# EAGLE design TubesSems3 (EAGLE 9.6.2)
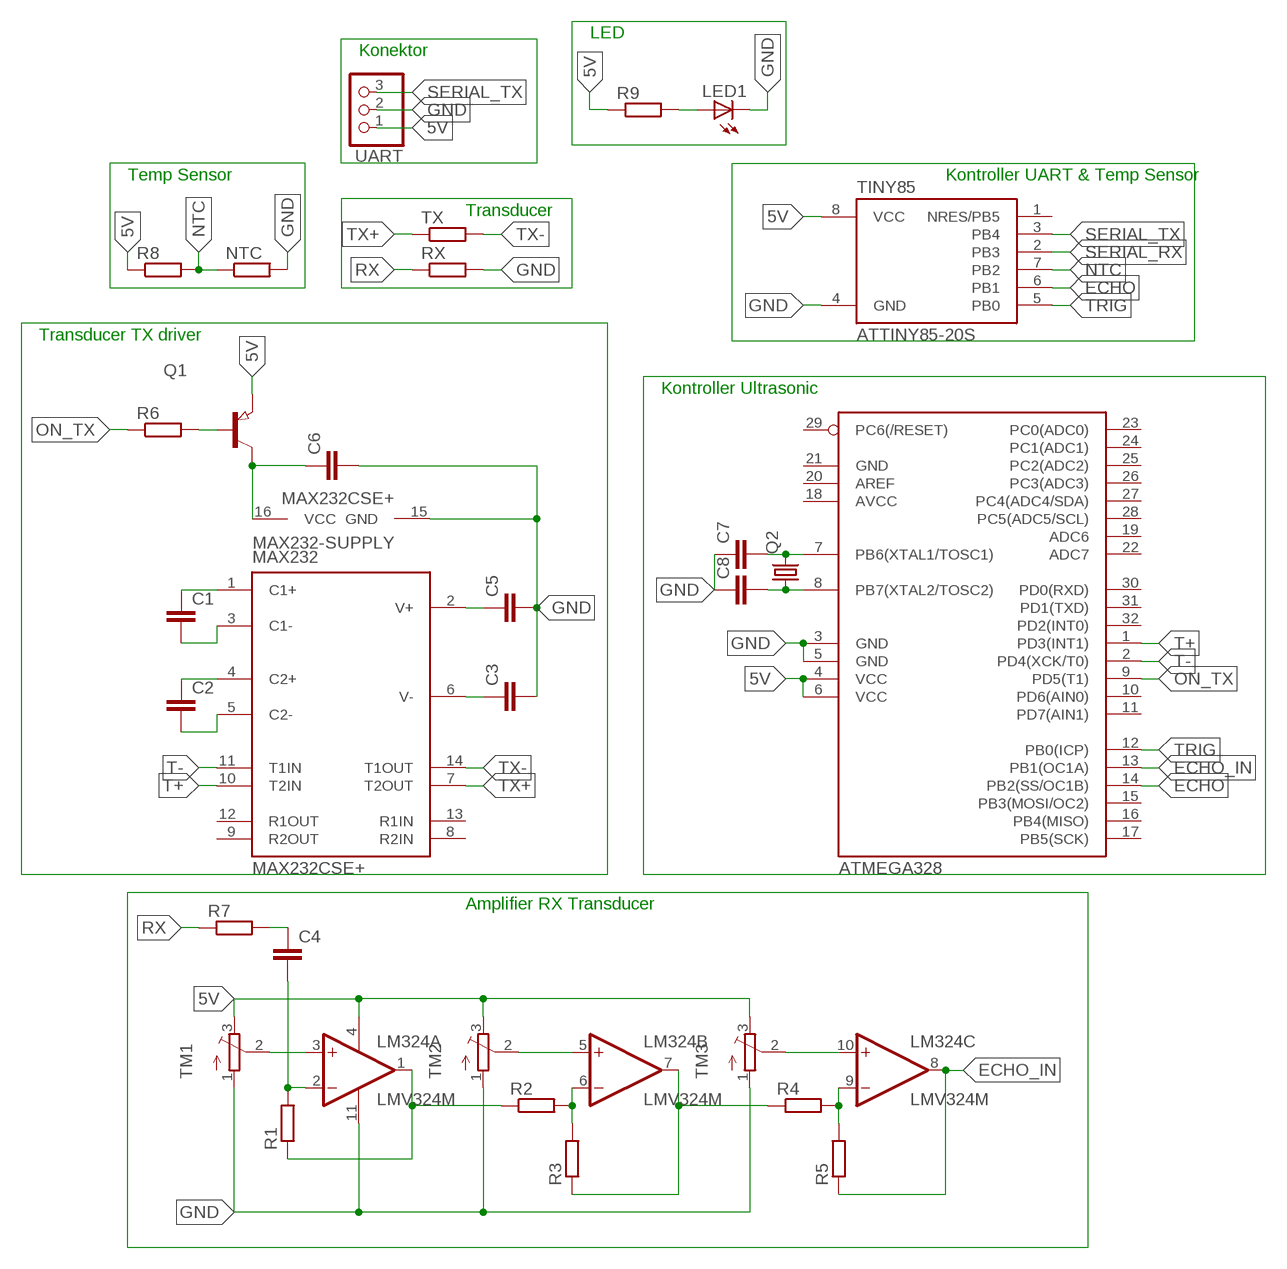
[diagram p0: schematic, sheet 1]

## Parts
ATMEGA328  MEGA8-AI  [TQFP32-08]
C1  C-EUC0603  [C0603]
C2  C-EUC0603  [C0603]
C3  C-EUC0603  [C0603]
C4  C-EUC0603  [C0603]
C5  C-EUC0603  [C0603]
C6  C-EUC0603  [C0603]
C7  C-EUC0805  [C0805]
C8  C-EUC0805  [C0805]
LED1  LEDCHIPLED_1206  [CHIPLED_1206]
LM324  LMV324M  [SO14]
MAX232  MAX232CSE+  [SO-16]
NTC  R-EU_R0805  [R0805]
Q1  PNP-TRANSISTOR_SOT23  [SOT23]
Q2  CRYSTALSM49  [SM49]
R1  R-EU_R1206  [R1206]
R2  R-EU_R1206  [R1206]
R3  R-EU_R1206  [R1206]
R4  R-EU_R1206  [R1206]
R5  R-EU_R1206  [R1206]
R6  R-EU_R1206  [R1206]
R7  R-EU_R1206  [R1206]
R8  R-EU_R0805  [R0805]
R9  R-EU_M1206  [M1206]
RX  R-EU_0207/11  [0207/11]
TINY85  ATTINY85-20S  [SOIC8_EIAJ_208MIL]
TM1  TRIMPOTTC33X  [TC33X]
TM2  TRIMPOTTC33X  [TC33X]
TM3  TRIMPOTTC33X  [TC33X]
TX  R-EU_0207/11  [0207/11]
UART  PINHD-1X3  [1X03]

## Nets
5V: ATMEGA328.4(VCC) ATMEGA328.6(VCC) LM324.4(P:V+) Q1.2(E) R8.1 R9.1 TINY85.8(VCC) TM1.3(E) TM2.3(E) TM3.3(E) UART.1
ECHO: ATMEGA328.14(PB2(SS/OC1B)) TINY85.6(PB1)
ECHO_IN: ATMEGA328.13(PB1(OC1A)) LM324.8(C:OUT) R5.1
GND: ATMEGA328.3(GND) ATMEGA328.5(GND) C3.2 C5.2 C6.2 C7.1 C8.1 LED1.C LM324.11(P:V-) MAX232.15(GND) NTC.2 RX.2 TINY85.4(GND) TM1.1(A) TM2.1(A) TM3.1(A) UART.2
N$1: C1.1 MAX232.1(C1+)
N$2: C1.2 MAX232.3(C1-)
N$3: C2.1 MAX232.4(C2+)
N$4: C2.2 MAX232.5(C2-)
N$5: C3.1 MAX232.6(V-)
N$6: C5.1 MAX232.2(V+)
N$7: ATMEGA328.7(PB6(XTAL1/TOSC1)) C7.2 Q2.2
N$8: C6.1 MAX232.16(VCC) Q1.3(C)
N$9: LM324.3(A:+IN) TM1.2(S)
N$10: C4.2 LM324.2(A:-IN) R1.2
N$11: LM324.1(A:OUT) R1.1 R2.1
N$12: LM324.5(B:+IN) TM2.2(S)
N$13: LM324.6(B:-IN) R2.2 R3.2
N$14: Q1.1(B) R6.2
N$15: LM324.7(B:OUT) R3.1 R4.1
N$16: LM324.10(C:+IN) TM3.2(S)
N$17: LM324.9(C:-IN) R4.2 R5.2
N$18: ATMEGA328.8(PB7(XTAL2/TOSC2)) C8.2 Q2.1
N$19: C4.1 R7.2
N$27: LED1.A R9.2
NTC: NTC.1 R8.2 TINY85.7(PB2)
ON_TX: ATMEGA328.9(PD5(T1)) R6.1
RX: R7.1 RX.1
SERIAL_RX: TINY85.2(PB3)
SERIAL_TX: TINY85.3(PB4) UART.3
T+: ATMEGA328.1(PD3(INT1)) MAX232.10(T2IN)
T-: ATMEGA328.2(PD4(XCK/T0)) MAX232.11(T1IN)
TRIG: ATMEGA328.12(PB0(ICP)) TINY85.5(PB0)
TX+: MAX232.7(T2OUT) TX.1
TX-: MAX232.14(T1OUT) TX.2
Unconnected: ATMEGA328.10(PD6(AIN0)) ATMEGA328.11(PD7(AIN1)) ATMEGA328.15(PB3(MOSI/OC2)) ATMEGA328.16(PB4(MISO)) ATMEGA328.17(PB5(SCK)) ATMEGA328.19(ADC6) ATMEGA328.20(AREF) ATMEGA328.22(ADC7) ATMEGA328.23(PC0(ADC0)) ATMEGA328.24(PC1(ADC1)) ATMEGA328.25(PC2(ADC2)) ATMEGA328.26(PC3(ADC3)) ATMEGA328.27(PC4(ADC4/SDA)) ATMEGA328.28(PC5(ADC5/SCL)) ATMEGA328.29(PC6(/RESET)) ATMEGA328.30(PD0(RXD)) ATMEGA328.31(PD1(TXD)) ATMEGA328.32(PD2(INT0)) LM324.12(D:+IN) LM324.13(D:-IN) LM324.14(D:OUT) MAX232.8(R2IN) MAX232.9(R2OUT) MAX232.12(R1OUT) MAX232.13(R1IN) TINY85.1(NRES/PB5)

## Notes on the sheet
- LED
- Konektor
- Temp Sensor | Kontroller UART & Temp Sensor
- Transducer
- Transducer TX driver
- Kontroller Ultrasonic
- Amplifier RX Transducer

## Power pins joined to a net without a drawn wire
AVCC: ATMEGA328.18(AVCC)
GND: ATMEGA328.21(GND)

## Library data of the parts
ATMEGA328 = atmel:MEGA8: MICROCONTROLLER 8 Kbytes FLASH, 1 kbytes SRAM, 512 bytes EEPROM, USART, 6-channel 10 bit ADC, 2-channel 8 bit ADC Pin compatible with Atmega48, ATMega88, ATMega168 Source: avr.lbr; MPN: ATMEGA8-16AU; OC_FARNELL: 9171371; OC_NEWARK: 73M8863
C1-C8 = Clean-Kong:C-EU: CAPACITOR, European symbol
LED1 = adafruit:LED: LED OSRAM: - CHIPLED LG R971, LG N971, LY N971, LG Q971, LY Q971, LO R971, LY R971 LH N974, LH R974 LS Q976, LO Q976, LY Q976 LO Q996 - Hyper CHIPLED LW Q18S LB Q993, LB Q99A, LB R99A - SideLED LS A670, LO A670, LY A670, LG A670, LP A670 LB A673, LV A673, LT A673, LW A673 LH A674 LY A675 LS A676, LA A676, LO A676, LY A676, LW A676 LS A679, LY A679, LG A679 - Hyper Micro SIDELED® LS Y876, LA Y876, LO Y876, LY Y876 LT Y87S - SmartLED LW L88C, LW L88S LB L89C, LB L89S, LG L890 LS L89K, LO L89K, LY L89K LS L896, LA L896, LO L896, LY L896 - TOPLED LS T670, LO T670, LY T670, LG T670, LP T670 LSG T670, LSP T670, LSY T670, LOP T670, LYG T670 LG T671, LOG T671, LSG T671 LB T673, LV T673, LT T673, LW T673 LH T674 LS T676, LA T676, LO T676, LY T676, LB T676, LH T676, LSB T676, LW T676 LB T67C, LV T67C, LT T67C, LS T67K, LO T67K, LY T67K, LW E67C LS E67B, LA E67B, LO E67B, LY E67B, LB E67C, LV E67C, LT E67C LW T67C LS T679, LY T679, LG T679 LS T770, LO T770, LY T770, LG T770, LP T770 LB T773, LV T773, LT T773, LW T773 LH T774 LS E675, LA E675, LY E675, LS T675 LS T776, LA T776, LO T776, LY T776, LB T776 LHGB T686 LT T68C, LB T68C - Hyper Mini TOPLED® LB M676 - Mini TOPLED Santana® LG M470 LS M47K, LO M47K, LY M47K Source: http://www.osram.convergy.de/
LM324 = linear:LMV324?*: Quad General Purpose, Low Voltage, Rail-to-Rail Output Operational Amplifiers Source: http://www.national.com/mpf/LM/LMV321.html http://www.national.com/dt/lmv_qual.pdf
MAX232 = maxim-volks73:MAX232*?: +5V-Powered, Multichannel RS-232 Drivers/Receivers Documentation Datasheet <http://datasheets.maximintegrated.com/en/ds/MAX220-MAX249.pdf> General Description The MAX220–MAX249 family of line drivers/receivers is intended for all EIA/TIA-232E and V.28/V.24 communications interfaces, particularly applications where ±12V is not available. The MAX225, MAX233, MAX235, and MAX245/MAX246/MAX247 use no external components and are recommended for applications where printed circuit board space is critical. The MAX220-MAX249 are offered in 26 different packages with temperatures from 0 to +70°C up to -55°C to +125°C. See ordering information table at the end of the data sheet for all package and temperature options. Applications Interface Translation Multidrop RS-232 Networks Portable Diagnostics Equipment Benefits and Features Saves Board Space Integrated Charge Pump Circuitry Eliminates the Need for a Bipolar ±12V Supply Enables the Single Supply Operation from +5V Supply Integrated Capacitors (MAX223, MAX233, MAX235, MAX245-MAX247) Saves Power for Reduced Power Requirements 5μW Shutdown Mode; CATEGORY: Integrated Circuits (ICs); DATA_RATE: 120Kbps; DESCRIPTION: IC RS-232 DVR/RCVR 16-SOIC; DOCUMENTATION_LINK: <a href="http://datasheets.maximintegrated.com/en/ds/MAX220-MAX249.pdf">Datasheet</a>; DOCUMENTATION_URL: http://datasheets.maximintegrated.com/en/ds/MAX220-MAX249.pdf; DUPLEX: Full; FAMILY: Interface - Drivers, Receivers, Transceivers; MANUFACTURER: Maxim Integrated; MOUNTING_TYPE: Surface Mount; NUMBER_OF_DRIVERS-RECEIVERS: 2/2; OPERATING_TEMPERATURE: 0°C ~ 70°C; PACKAGE: 16-SOIC (0.154", 3.90mm Width); PART_NUMBER: MAX232CSE+; PROTOCOL: RS232; RECEIVER_HYSTERESIS: 500mV; SERIES: -; SUPPLIER_DEVICE_PACKAGE: 16-SOIC; SUPPLIER_ITEM_LINK: <a href="http://www.digikey.com/product-detail/en/MAX232CSE%2B/MAX232CSE%2B-ND/1513858">Details</a>; SUPPLIER_ITEM_NUMBER: MAX232CSE+-ND; SUPPLIER_ITEM_URL: http://www.digikey.com/product-detail/en/MAX232CSE%2B/MAX232CSE%2B-ND/1513858; SUPPLIER_LINK: <a href="http://www.digikey.com">Home Page</a>; SUPPLIER_NAME: Digi-Key; SUPPLIER_URL: http://www.digikey.com; TYPE: Transceiver; VOLTAGE-SUPPLY: 4.5 V ~ 5.5 V
NTC R1-R9 RX TX = Clean-Kong:R-EU_: RESISTOR, European symbol
Q1 = semicon-smd-ipc:PNP-TRANSISTOR_: PNP TRANSISTOR
Q2 = adafruit:CRYSTAL: CRYSTAL; OC_FARNELL: unknown; OC_NEWARK: unknown
TINY85 = attiny25_45_85:ATTINY85*: ATMEL ATtiny 85 Packages: P = PDIP 08 30mil S = SOIC 08 EIAJ 208mil Technologies Note: for complete ordering code (temp. range, finish, tape&reel etc.) see www.atmel.com • Supply Voltage: V = (1.8…5.5)V | [blank] = (2.7…5.5)V • Speed: 10 = 10 MHz | 20 = 20 MHz Author: Dipl.-Ing. FH Rainer Bayer HHN Hochschule Heilbronn (Heilbronn University), rainer.bayer@hs-heilbronn.de Ingenieurbüro ing-rb, mail@ing-rb.de
TM1-TM3 = adafruit:TRIMPOT: SMT trimmer potentiometer part number TC33X http://www.ladyada.net/library/eagle
UART = pinhead:PINHD-1X3: PIN HEADER

## Board
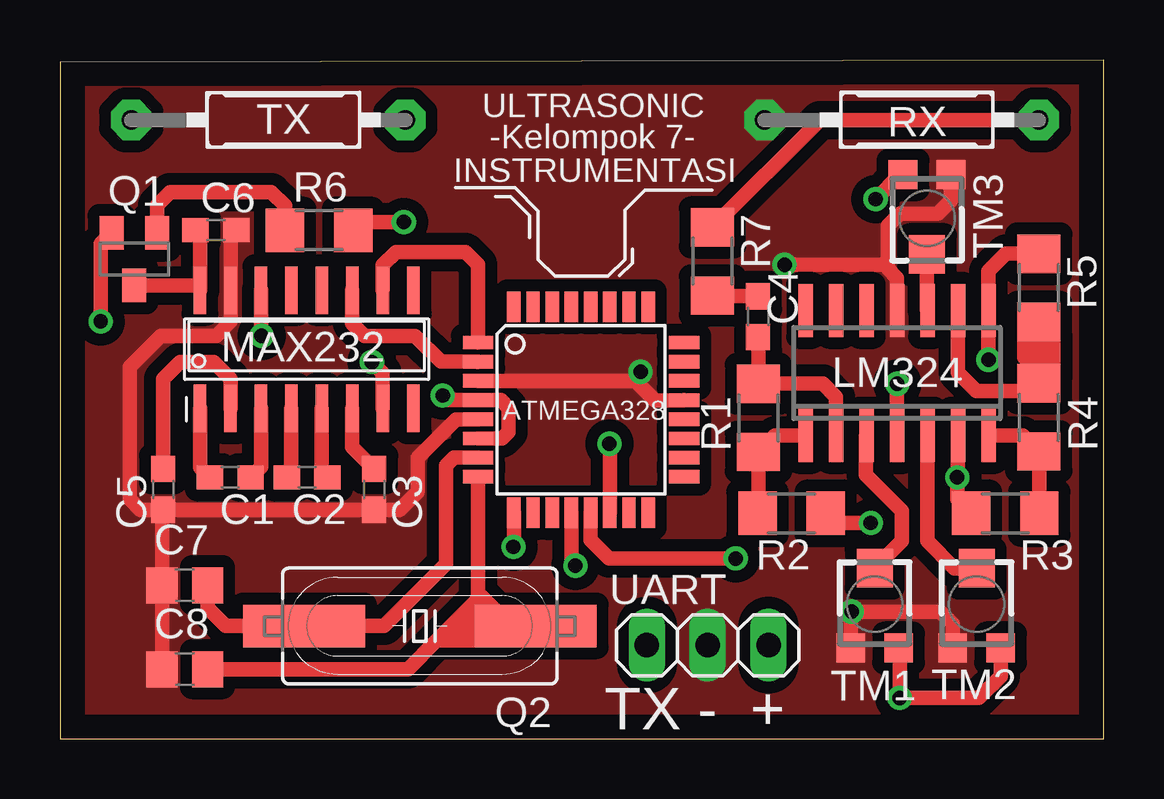
[diagram p1: board, top side]
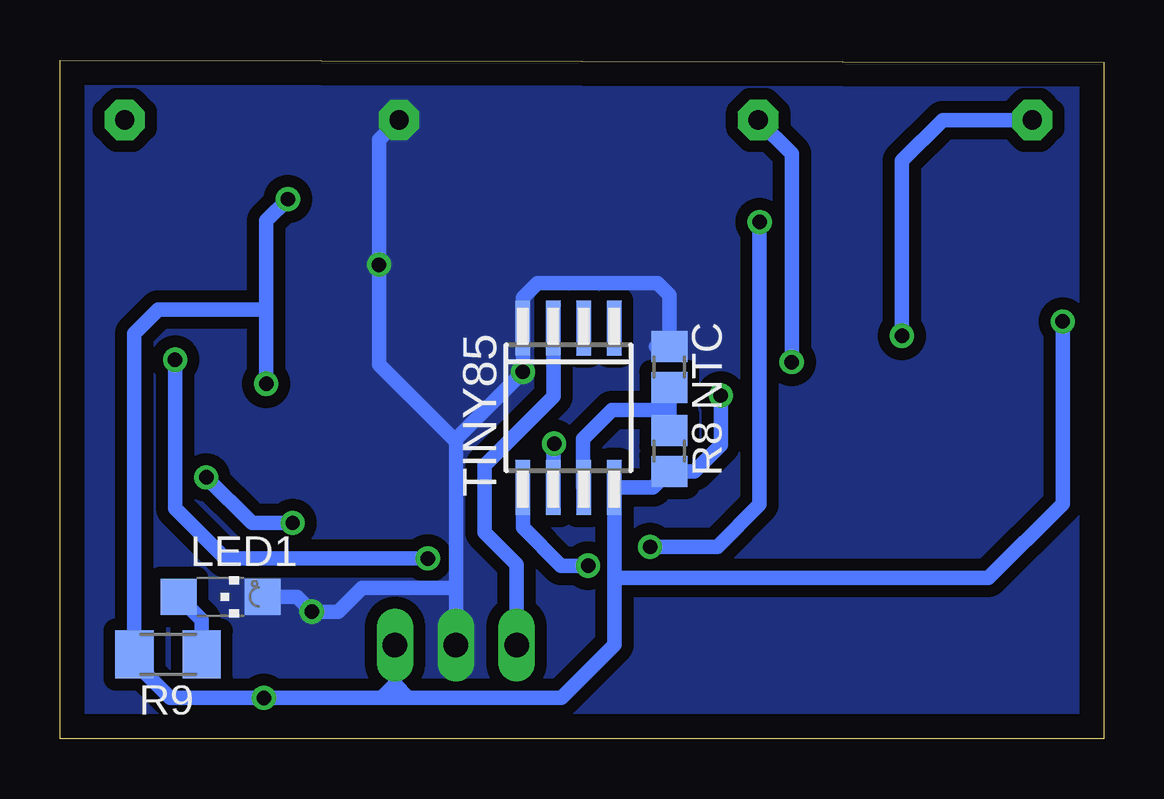
[diagram p2: board, bottom side, seen from below]

Size 43.5 x 28.3 mm. Coordinates in mm from the lower left corner, seen from the top.
Outline: 0,0 43.5,0 43.5,28.3 0,28.2 0,0
Copper layers (1*16): Top 0.035mm / dielectric 1.5mm / Bottom 0.035mm
Design rules "default": minimum track width 6mil, minimum drill 0.35mm, track to track 6mil, track to pad 6mil, pad to pad 6mil, via to via 6mil, smd to smd 6mil, copper to edge 40mil, drill to drill 6mil, minimum pad ring 10mil, minimum via ring 8mil, stop-mask expansion 4mil, vias tented up to drill 0mil, thermal gap 10mil

### Footprints (pad centres in the part's own frame; a part is rotated, then mirrored left to right if it is on the bottom)
TQFP32-08 = smd 1.27 x 0.559: 1 -4.293,2.8; 2 -4.293,2; 3 -4.293,1.2; 4 -4.293,0.4; 5 -4.293,-0.4; 6 -4.293,-1.2; 7 -4.293,-2; 8 -4.293,-2.8; 17 4.293,-2.8; 18 4.293,-2; 19 4.293,-1.2; 20 4.293,-0.4; 21 4.293,0.4; 22 4.293,1.2; 23 4.293,2; 24 4.293,2.8 | smd 0.559 x 1.27: 9 -2.8,-4.293; 10 -2,-4.293; 11 -1.2,-4.293; 12 -0.4,-4.293; 13 0.4,-4.293; 14 1.2,-4.293; 15 2,-4.293; 16 2.8,-4.293; 25 2.8,4.293; 26 2,4.293; 27 1.2,4.293; 28 0.4,4.293; 29 -0.4,4.293; 30 -1.2,4.293; 31 -2,4.293; 32 -2.8,4.293
C0603 = smd 1.1 x 1: 1 -0.85,0; 2 0.85,0
C0805 = smd 1.3 x 1.5: 1 -0.95,0; 2 0.95,0
CHIPLED_1206 = smd 1.5 x 1.5: A 0,-1.75; C 0,1.75
SO14 = smd 0.6 x 2.2: 1 -3.81,-2.6; 2 -2.54,-2.6; 3 -1.27,-2.6; 4 0,-2.6; 5 1.27,-2.6; 6 2.54,-2.6; 7 3.81,-2.6; 8 3.81,2.6; 9 2.54,2.6; 10 1.27,2.6; 11 0,2.6; 12 -1.27,2.6; 13 -2.54,2.6; 14 -3.81,2.6
SO-16 = smd 1.98 x 0.53: 1 -2.465,4.445; 2 -2.465,3.175; 3 -2.465,1.905; 4 -2.465,0.635; 5 -2.465,-0.635; 6 -2.465,-1.905; 7 -2.465,-3.175; 8 -2.465,-4.445; 9 2.465,-4.445; 10 2.465,-3.175; 11 2.465,-1.905; 12 2.465,-0.635; 13 2.465,0.635; 14 2.465,1.905; 15 2.465,3.175; 16 2.465,4.445
R0805 = smd 1.3 x 1.5: 1 -0.85,0; 2 0.85,0
SOT23 = smd 1 x 1.4: 1 -0.95,-1.1; 2 0.95,-1.1; 3 0,1.1
SM49 = smd 5.08 x 1.778: 1 -4.826,0; 2 4.826,0
R1206 = smd 1.6 x 1.803: 1 -1.422,0; 2 1.422,0
M1206 = smd 1.6 x 2: 1 -1.4,0; 2 1.4,0
0207/11 = drill 0.8 pad 1.676 octagon: 1 0,0; 2 11.43,0
SOIC8_EIAJ_208MIL = smd 0.6 x 2.286: 1 -1.905,-3.33; 2 -0.635,-3.33; 3 0.635,-3.33; 4 1.905,-3.33; 5 1.905,3.33; 6 0.635,3.33; 7 -0.635,3.33; 8 -1.905,3.33
TC33X = smd 1.2 x 1.2: 1 -1,-1.825; 3 1,-1.825 | smd 1.5 x 1.6: 2 0,1.5
1X03 = drill 1.016 long: 1 -2.54,0; 2 0,0; 3 2.54,0

### Placement (x,y rotation side)
ATMEGA328  21.72,13.72 0 top
C1  7.1,10.9 0 top
C2  10.3,10.9 0 top
C3  13.1,10.4 270 top
C4  29.1,17.6 270 top
C5  4.3,10.4 270 top
C6  6.5,21.2 0 top
C7  5.2,6.4 0 top
C8  5.2,2.9 0 top
LED1  36.81,5.91 270 bottom
LM324  34.89,15.25 0 top
MAX232  10.28,16.24 90 top
NTC  18.1,15.5 90 bottom
Q1  3.1,20 180 top
Q2  15,4.7 180 top
R1  29.11,13.38 90 top
R2  30.5,9.4 0 top
R3  39.4,9.4 180 top
R4  40.8,13.4 90 top
R5  40.8,18.8 270 top
R6  10.8,21.2 180 top
R7  27.2,19.9 270 top
R8  18.1,12 90 bottom
R9  38.99,3.51 0 bottom
RX  40.8,25.8 180 top
TINY85  22.3,13.8 180 bottom
TM1  33.96,5.61 0 top
TM2  38.21,5.61 0 top
TM3  36.14,21.69 180 top
TX  14.4,25.8 180 top
UART  27,3.9 180 top

### Tracks (layer width: path | path; a pad name or v marks a point on that pad's centre or on a via)
5V  (via drill 0.6)
  Top 0.61: 39.21,3.71 TM2.3 39.21,2.61 38.3,1.7 v35,1.7 35,3.75 TM1.3 | LM324.4 v34.89,14.79 v34.9,14.8 | v34,22.5 35.02,23.52 TM3.3 | v15.95,14.31 16.14,14.12 ATMEGA328.4 18.38,14.12 18.7,13.8 18.7,12.8 18.42,12.52 ATMEGA328.6 | v1.7,17.4 1.7,20.65 Q1.2
  Bottom 0.152: R9.1 40.39,5.11 40.4,5.11
  Bottom 0.61: 29.54,3.16 UART.1 29.54,2.26 | v34.9,14.8 34.9,17.9 | 34.9,17.9 34.9,21.6 v34,22.5 | v15.95,14.31 15.95,12.25 17.05,11.15 R8.1 18.78,10.47 TINY85.8 20.39,6.7 | 20.39,6.7 20.39,3.91 22.6,1.7 28.98,1.7 | 28.98,1.7 29.5,1.7 | 29.5,1.7 30.1,1.7 | 30.1,1.7 v35,1.7 38.9,1.7 40.4,3.2 40.4,5.11 40.4,16.9 39.4,17.9 34.9,17.9 | 29.54,2.26 29.54,1.74 29.5,1.7 | 20.39,6.7 4.8,6.7 1.7,9.8 v1.7,17.4 | 29.54,2.26 28.98,1.7 | 29.54,2.26 30.1,1.7
ECHO  (via drill 0.6)
  Top 0.61: ATMEGA328.14 22.92,12.28 v22.9,12.3
  Bottom 0.61: v22.9,12.3 22.93,12.3 TINY85.6
ECHO_IN  (via drill 0.6)
  Top 0.61: R5.1 39.42,20.22 38.7,19.5 LM324.8 v38.7,15.8 | ATMEGA328.13 22.12,8.28 22.89,7.51 v28.16,7.51
  Bottom 0.61: v28.16,7.51 36.61,7.51 38.7,9.6 v38.7,15.8
GND  (via drill 0.6)
  Top 0.61: C5.2 C3.2 14.15,9.55 14.9,10.3 14.9,11.7 16.52,13.32 ATMEGA328.5 | C5.2 4.25,9.5 C7.1 C8.1 | C5.2 3.35,9.55 2.9,10 2.9,15.5 4.2,16.8 6.5,16.8 7.11,17.41 MAX232.15 7.11,20.96 C6.2 | v24.2,15.3 24.2,14.7 | 24.2,14.7 24.8,14.1 25.99,14.1 ATMEGA328.21 | TM2.1 37.21,4.79 36.7,5.3 v33,5.3 32.96,5.26 TM1.1 | LM324.11 34.89,19.21 34.5,19.6 34.5,19.76 | TM3.1 37.14,22.44 36.6,21.9 35,21.9 34.5,21.4 34.5,19.77 v30.2,19.77 | ATMEGA328.3 23.98,14.92 24.2,14.7
  Bottom 0.61: 18.65,16.35 NTC.2 18.1,18.5 18.6,19 23.6,19 24.21,18.39 TINY85.4 v24.21,15.3 v24.2,15.3 27,12.5 27,12.4 | 27,12.4 27,6.3 | 27,6.3 UART.2 | 27,6.3 30.9,6.3 31.9,5.3 v33,5.3 33.61,5.92 LED1.C | 27,12.4 30.2,15.6 v30.2,19.77 30.2,24.97 RX.2
  pour Top (isolate 0.5, no thermals): 0,28.4 43.7,28.4 43.7,-0.2 0,-0.2
  pour Bottom (isolate 0.5, no thermals): 0,28.4 43.6,28.4 43.6,-0.1 0,-0.1
N$1
  Top 0.61: MAX232.1 5.84,11.32 C1.1
N$2
  Top 0.61: C1.2 8.38,11.32 MAX232.3
N$3
  Top 0.61: MAX232.4 9.64,11.09 C2.1
N$4
  Top 0.61: MAX232.5 10.91,11.14 C2.2
N$5
  Top 0.61: MAX232.6 12.18,12.16 C3.1
N$6
  Top 0.61: C5.1 4.3,15 5,15.7 6.4,15.7 7.11,15 MAX232.2
N$7
  Top 0.61: C7.2 6.15,5.45 6.9,4.7 Q2.2 13.5,4.7 16.1,7.3 16.1,11.4 16.42,11.72 ATMEGA328.7
N$8
  Top 0.61: C6.1 5.84,21.02 5.84,19 | 5.84,19 MAX232.16 | Q1.3 5.73,18.9 5.84,19
N$9
  Top 0.61: LM324.3 33.6,12.63 33.6,11 35.1,9.5 35.1,8.25 TM1.2
N$10
  Top 0.61: R1.2 31.8,14.8 32.35,14.25 LM324.2 | 29.15,14.84 R1.2 | C4.2 R1.2
N$11
  Top 0.61: R1.1 29.11,11.67 | R1.1 29.11,9.43 R2.1 | LM324.1 29.8,12.65 R1.1
N$12
  Top 0.61: TM2.2 37.29,7.11 36.16,8.24 LM324.5
N$13  (via drill 0.6)
  Top 0.61: v33.8,9 32.32,9 R2.2 | LM324.6 37.43,10.93 v37.4,10.9 37.4,9.98 R3.2
  Bottom 0.61: v33.8,9 35.5,9 v37.4,10.9
N$14
  Top 0.61: Q1.1 4.05,22.25 4.6,22.8 8.8,22.8 9.38,22.22 R6.2
N$15
  Top 0.61: LM324.7 40.13,12.65 R4.1 40.82,11.96 R3.1
N$16
  Top 0.61: TM3.2 36.14,17.87 LM324.10
N$17
  Top 0.61: R5.2 40.8,15.3 | 40.8,15 R4.2 41.12,14.82 41.4,15.1 41.4,16.78 R5.2 | R5.2 40.32,16.9 40.2,16.9 40.2,15.9 40.8,15.3 | LM324.9 37.43,15.27 38.2,14.5 40.3,14.5 40.8,15 | 40.8,15 40.8,15.3
N$18
  Top 0.61: C8.2 14.5,2.9 15.7,4.1 | 15.7,4.1 16.3,4.7 | 16.3,4.7 17.3,4.7 | 17.3,4.7 17.4,4.7 | 18.2,4.7 18.8,4.7 | ATMEGA328.8 17.43,6.07 | 17.43,6.07 17.43,4.83 17.3,4.7 | 17.43,6.07 17.65,5.85 | 17.65,5.85 18.8,4.7 | 16.3,4.7 16.85,5.25 | 16.85,5.25 17.45,5.85 17.65,5.85 | Q2.1 18.8,4.7 | 18.2,4.7 17.4,4.7 | 17.4,4.7 16.85,5.25 | 15.7,4.1 17.6,4.1 18.2,4.7
N$19
  Top 0.61: 27.22,18.5 R7.2 27.23,18.45 C4.1
N$27
  Bottom 0.61: R9.2 37.59,4.95 LED1.A
NTC
  Bottom 0.61: NTC.1 18.1,13.7 | 18.1,13.7 R8.2 | 18.1,13.7 20.5,13.7 21.7,12.5 21.7,10.5 TINY85.7
ON_TX  (via drill 0.6)
  Top 0.61: ATMEGA328.9 18.92,8.12 18.9,8.1 v18.9,8 | v14.34,21.54 12.56,21.54 R6.1
  Bottom 0.61: v18.9,8 16.1,8 14.34,9.76 v14.34,21.54
RX
  Top 0.61: R7.1 31.68,25.8 RX.1
SERIAL_TX
  Bottom 0.61: TINY85.3 22.93,14.27 24.9,12.3 | 24.9,12.3 25.8,11.4 25.8,8.6 24.46,7.26 UART.3 | 24.9,12.3
T+
  Top 0.61: MAX232.10 13.45,19.75 14,20.3 16.9,20.3 17.43,19.77 ATMEGA328.1
T-
  Top 0.61: 17.41,15.7 ATMEGA328.2 15.88,15.72 14.8,16.8 12.7,16.8 12.18,17.32 MAX232.11
TRIG  (via drill 0.6)
  Top 0.61: ATMEGA328.12 21.32,7.38 v21.49,7.22
  Bottom 0.61: TINY85.5 24.21,8.8 22.62,7.22 v21.49,7.22
TX+  (via drill 0.6)
  Top 0.61: MAX232.7 13.45,15.25 v13,15.7
  Bottom 0.61: v13,15.7 13,24.4 TX.1
TX-  (via drill 0.6)
  Top 0.61: MAX232.14 8.38,16.82 v8.4,16.8
  Bottom 0.61: v8.4,16.8 8.4,24.1 6.7,25.8 TX.2

### Text on the board
tPlace: ULTRASONIC | -Kelompok 7- | INSTRUMENTASI | TX - +